# Altium project sigjumper-top.PrjPcb
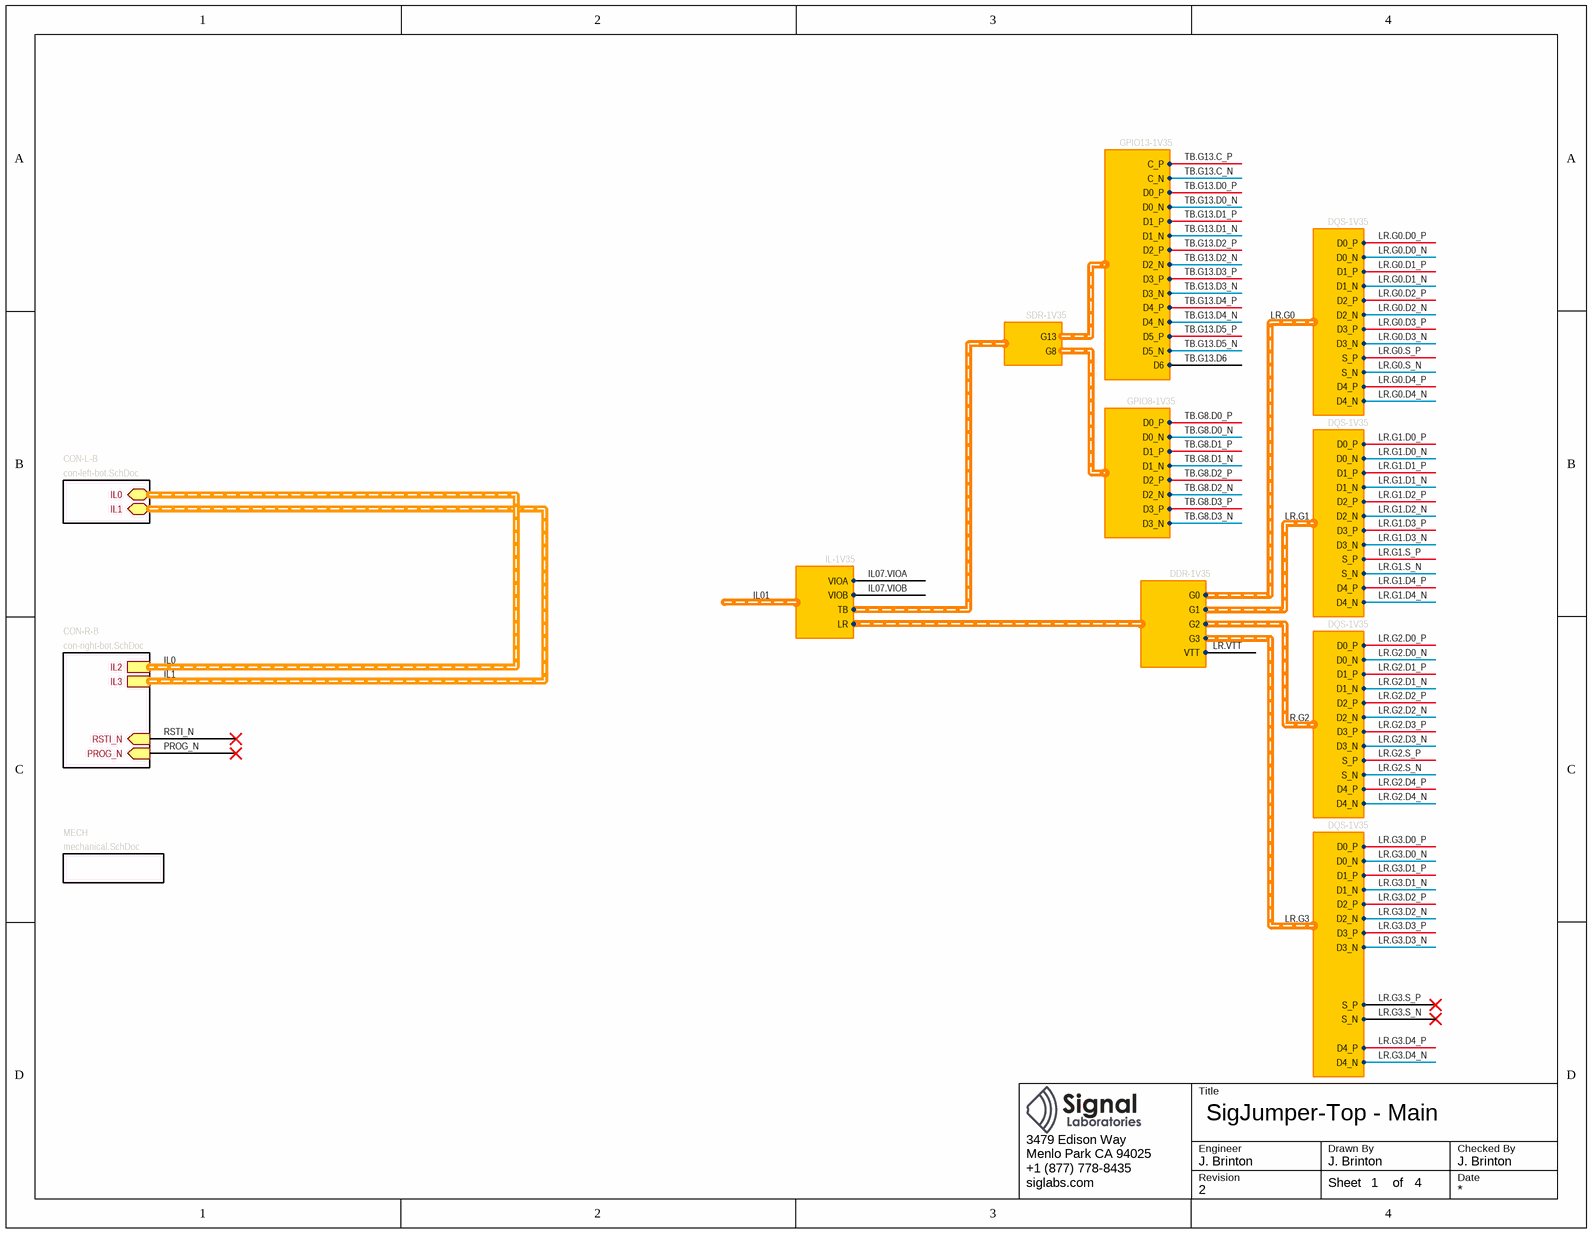
[diagram p0: main.SchDoc]
4 sheets, 24 parts. Net scope: hierarchical (ports join the sheet entries above them; power ports are global).
Board file: sigjumper-top.PcbDoc
Sheets:
  main.SchDoc
    CON-L-B = con-left-bot.SchDoc
    CON-R-B = con-right-bot.SchDoc
    MECH = mechanical.SchDoc

## Sheet main.SchDoc: SigJumper-Top - Main
size Letter; CheckedBy: J. Brinton; CompanyName: Signal Laboratories, Inc.; DrawnBy: J. Brinton; Engineer: J. Brinton; Address1: 3479 Edison Way; Address2: Menlo Park CA 94025; Address3: +1 (877) 778-8435; Address4: siglabs.com; Revision: 2; SheetNumber: 1; SheetTotal: 4

### Sub-sheets
CON-L-B = con-left-bot.SchDoc: IL0 (harness IL-1V35), IL1 (harness IL-1V35)
CON-R-B = con-right-bot.SchDoc: IL3 (harness IL-1V35), RSTI_N (in), PROG_N (in), IL2 (harness IL-1V35)
MECH = mechanical.SchDoc: no entries

### Harnesses
GPIO8-1V35: D0_P, D0_N, D1_P, D1_N, D2_P, D2_N, D3_P, D3_N
SDR-1V35: G13, G8
GPIO13-1V35: C_P, C_N, D0_P, D0_N, D1_P, D1_N, D2_P, D2_N, D3_P, D3_N, D4_P, D4_N, D5_P, D5_N, D6
DQS-1V35: D0_P, D0_N, D1_P, D1_N, D2_P, D2_N, D3_P, D3_N, D4_P, D4_N, S_P, S_N
DDR-1V35: G0, G1, G2, G3, VTT
IL-1V35: LR, TB, VIOA, VIOB

### Nets
IL07.VIOA: harness IL-1V35.VIOA  [project net IL01.VIOA]
IL07.VIOB: harness IL-1V35.VIOB  [project net IL01.VIOB]
LR.G0.D0_N: harness DQS-1V35.D0_N
LR.G0.D0_P: harness DQS-1V35.D0_P
LR.G0.D1_N: harness DQS-1V35.D1_N
LR.G0.D1_P: harness DQS-1V35.D1_P
LR.G0.D2_N: harness DQS-1V35.D2_N
LR.G0.D2_P: harness DQS-1V35.D2_P
LR.G0.D3_N: harness DQS-1V35.D3_N
LR.G0.D3_P: harness DQS-1V35.D3_P
LR.G0.D4_N: harness DQS-1V35.D4_N
LR.G0.D4_P: harness DQS-1V35.D4_P
LR.G0.S_N: harness DQS-1V35.S_N
LR.G0.S_P: harness DQS-1V35.S_P
LR.G1.D0_N: harness DQS-1V35.D0_N
LR.G1.D0_P: harness DQS-1V35.D0_P
LR.G1.D1_N: harness DQS-1V35.D1_N
LR.G1.D1_P: harness DQS-1V35.D1_P
LR.G1.D2_N: harness DQS-1V35.D2_N
LR.G1.D2_P: harness DQS-1V35.D2_P
LR.G1.D3_N: harness DQS-1V35.D3_N
LR.G1.D3_P: harness DQS-1V35.D3_P
LR.G1.D4_N: harness DQS-1V35.D4_N
LR.G1.D4_P: harness DQS-1V35.D4_P
LR.G1.S_N: harness DQS-1V35.S_N
LR.G1.S_P: harness DQS-1V35.S_P
LR.G2.D0_N: harness DQS-1V35.D0_N
LR.G2.D0_P: harness DQS-1V35.D0_P
LR.G2.D1_N: harness DQS-1V35.D1_N
LR.G2.D1_P: harness DQS-1V35.D1_P
LR.G2.D2_N: harness DQS-1V35.D2_N
LR.G2.D2_P: harness DQS-1V35.D2_P
LR.G2.D3_N: harness DQS-1V35.D3_N
LR.G2.D3_P: harness DQS-1V35.D3_P
LR.G2.D4_N: harness DQS-1V35.D4_N
LR.G2.D4_P: harness DQS-1V35.D4_P
LR.G2.S_N: harness DQS-1V35.S_N
LR.G2.S_P: harness DQS-1V35.S_P
LR.G3.D0_N: harness DQS-1V35.D0_N
LR.G3.D0_P: harness DQS-1V35.D0_P
LR.G3.D1_N: harness DQS-1V35.D1_N
LR.G3.D1_P: harness DQS-1V35.D1_P
LR.G3.D2_N: harness DQS-1V35.D2_N
LR.G3.D2_P: harness DQS-1V35.D2_P
LR.G3.D3_N: harness DQS-1V35.D3_N
LR.G3.D3_P: harness DQS-1V35.D3_P
LR.G3.D4_N: harness DQS-1V35.D4_N
LR.G3.D4_P: harness DQS-1V35.D4_P
LR.G3.S_N: harness DQS-1V35.S_N
LR.G3.S_P: harness DQS-1V35.S_P
LR.VTT: harness DDR-1V35.VTT
TB.G8.D0_N: harness GPIO8-1V35.D0_N
TB.G8.D0_P: harness GPIO8-1V35.D0_P
TB.G8.D1_N: harness GPIO8-1V35.D1_N
TB.G8.D1_P: harness GPIO8-1V35.D1_P
TB.G8.D2_N: harness GPIO8-1V35.D2_N
TB.G8.D2_P: harness GPIO8-1V35.D2_P
TB.G8.D3_N: harness GPIO8-1V35.D3_N
TB.G8.D3_P: harness GPIO8-1V35.D3_P
TB.G13.C_N: harness GPIO13-1V35.C_N
TB.G13.C_P: harness GPIO13-1V35.C_P
TB.G13.D0_N: harness GPIO13-1V35.D0_N
TB.G13.D0_P: harness GPIO13-1V35.D0_P
TB.G13.D1_N: harness GPIO13-1V35.D1_N
TB.G13.D1_P: harness GPIO13-1V35.D1_P
TB.G13.D2_N: harness GPIO13-1V35.D2_N
TB.G13.D2_P: harness GPIO13-1V35.D2_P
TB.G13.D3_N: harness GPIO13-1V35.D3_N
TB.G13.D3_P: harness GPIO13-1V35.D3_P
TB.G13.D4_N: harness GPIO13-1V35.D4_N
TB.G13.D4_P: harness GPIO13-1V35.D4_P
TB.G13.D5_N: harness GPIO13-1V35.D5_N
TB.G13.D5_P: harness GPIO13-1V35.D5_P
TB.G13.D6: harness GPIO13-1V35.D6

### Buses and harness runs
harness IL0 = sheet CON-L-B/IL0 = sheet CON-R-B/IL2
harness IL1 = sheet CON-L-B/IL1 = sheet CON-R-B/IL3

### Notes on the sheet
- Title
- Engineer
- Revision
- Drawn By
- Checked By
- Date
- Sheet
- of

## Sheet con-left-bot.SchDoc: SigJumper-Top - Left Bottom
size Letter; CheckedBy: J. Brinton; CompanyName: Signal Laboratories, Inc.; DrawnBy: J. Brinton; Engineer: J. Brinton; Address1: 3479 Edison Way; Address2: Menlo Park CA 94025; Address3: +1 (877) 778-8435; Address4: siglabs.com; Revision: 2; SheetNumber: 4; SheetTotal: 4
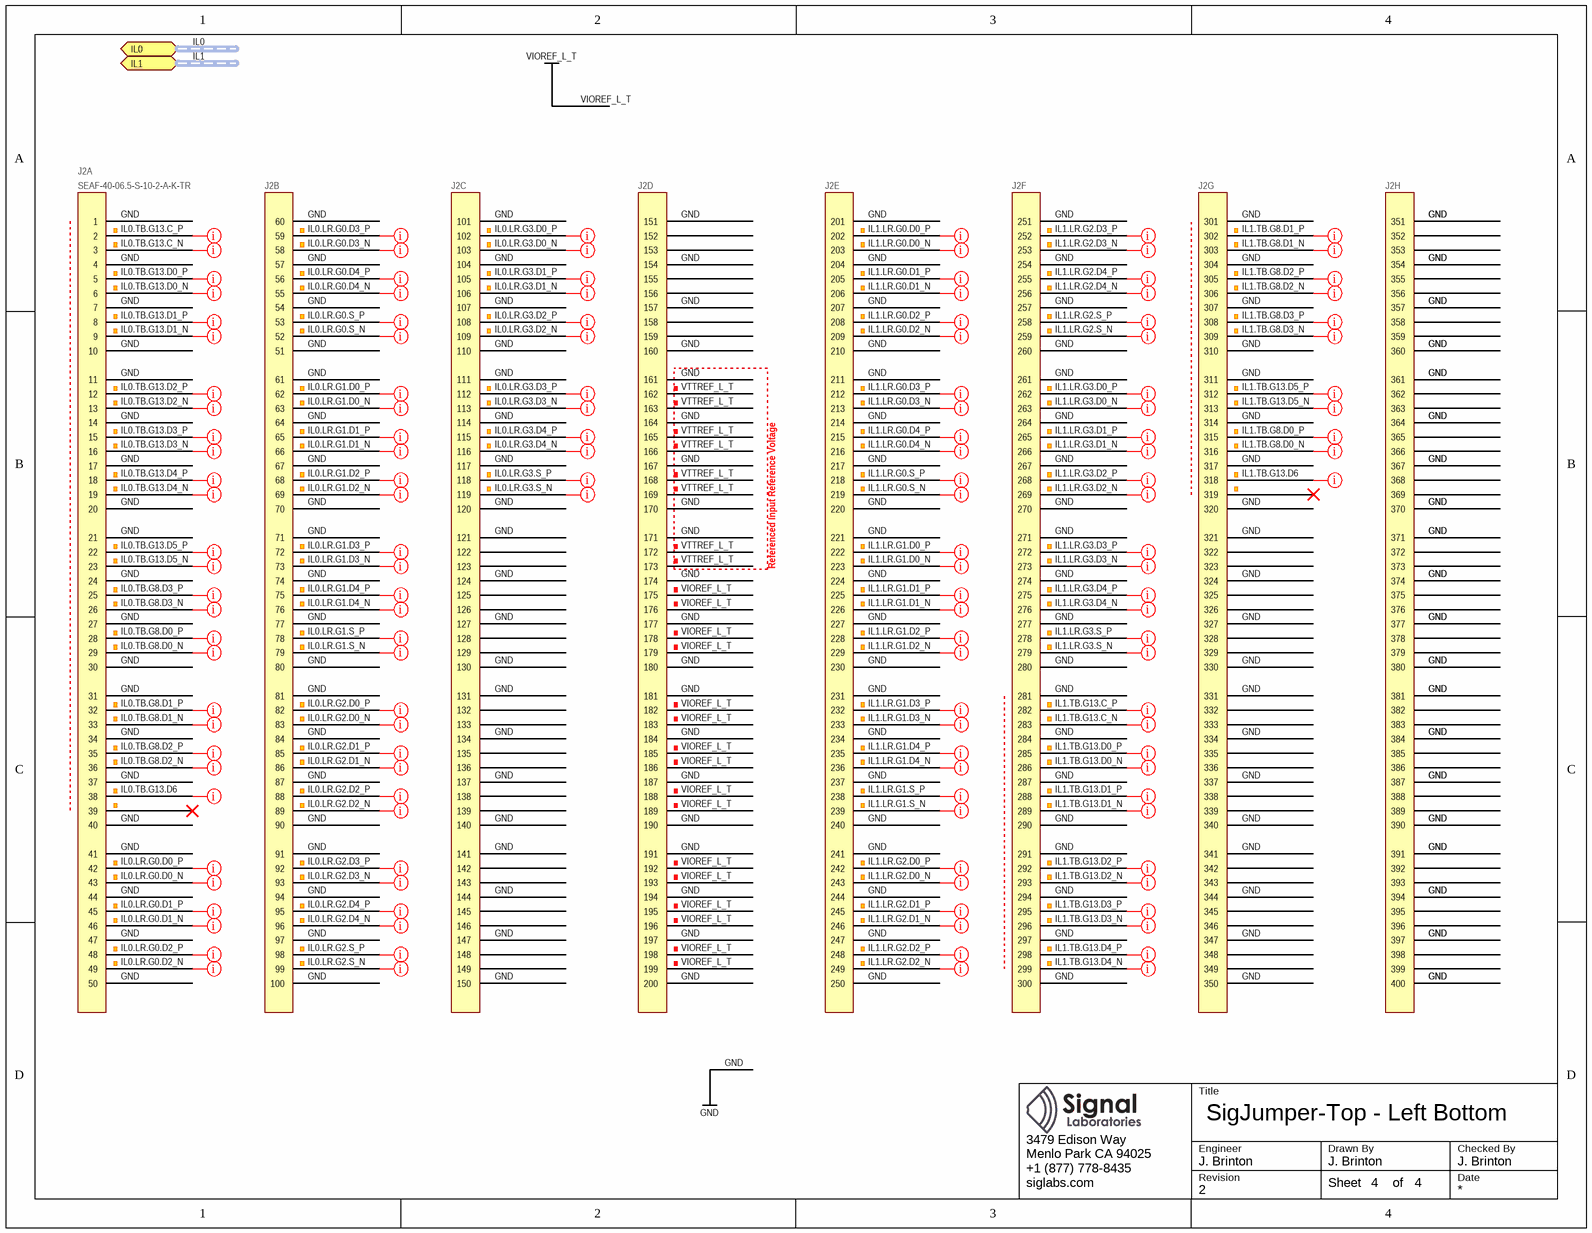
[diagram p1: con-left-bot.SchDoc]

### Parts
J2  SEAF-40-06.5-S-10-2-A-K-TR  [SEAF-40-06.5-S-10-2-A-K-TR]  (parts A,B,C,D,E,F,G,H of 8)

### Ports
IL0 (harness IL-1V35), IL1 (harness IL-1V35)

### Nets
GND: J2.1 J2.4 J2.7 J2.10 J2.11 J2.14 J2.17 J2.20 J2.21 J2.24 J2.27 J2.30 J2.31 J2.34 J2.37 J2.40 J2.41 J2.44 J2.47 J2.50 J2.51 J2.54 J2.57 J2.60 J2.61 J2.64 J2.67 J2.70 J2.71 J2.74 J2.77 J2.80 J2.81 J2.84 J2.87 J2.90 J2.91 J2.94 J2.97 J2.100 J2.101 J2.104 J2.107 J2.110 J2.111 J2.114 J2.117 J2.120 J2.121 J2.124 J2.127 J2.130 J2.131 J2.134 J2.137 J2.140 J2.141 J2.144 J2.147 J2.150 J2.151 J2.154 J2.157 J2.160 J2.161 J2.164 J2.167 J2.170 J2.171 J2.174 J2.177 J2.180 J2.181 J2.184 J2.187 J2.190 J2.191 J2.194 J2.197 J2.200 J2.201 J2.204 J2.207 J2.210 J2.211 J2.214 J2.217 J2.220 J2.221 J2.224 J2.227 J2.230 J2.231 J2.234 J2.237 J2.240 J2.241 J2.244 J2.247 J2.250 J2.251 J2.254 J2.257 J2.260 J2.261 J2.264 J2.267 J2.270 J2.271 J2.274 J2.277 J2.280 J2.281 J2.284 J2.287 J2.290 J2.291 J2.294 J2.297 J2.300 J2.301 J2.304 J2.307 J2.310 J2.311 J2.314 J2.317 J2.320 J2.321 J2.324 J2.327 J2.330 J2.331 J2.334 J2.337 J2.340 J2.341 J2.344 J2.347 J2.350 J2.351 J2.354 J2.357 J2.360 J2.361 J2.364 J2.367 J2.370 J2.371 J2.374 J2.377 J2.380 J2.381 J2.384 J2.387 J2.390 J2.391 J2.394 J2.397 J2.400
VIOREF_L_T: J2.175 J2.176 J2.178 J2.179 J2.182 J2.183 J2.185 J2.186 J2.188 J2.189 J2.192 J2.193 J2.195 J2.196 J2.198 J2.199
IL0.LR.G0.D0_N: J2.43
IL0.LR.G0.D0_P: J2.42
IL0.LR.G0.D1_N: J2.46
IL0.LR.G0.D1_P: J2.45
IL0.LR.G0.D2_N: J2.49
IL0.LR.G0.D2_P: J2.48
IL0.LR.G0.D3_N: J2.58
IL0.LR.G0.D3_P: J2.59
IL0.LR.G0.D4_N: J2.55
IL0.LR.G0.D4_P: J2.56
IL0.LR.G0.S_N: J2.52
IL0.LR.G0.S_P: J2.53
IL0.LR.G1.D0_N: J2.63
IL0.LR.G1.D0_P: J2.62
IL0.LR.G1.D1_N: J2.66
IL0.LR.G1.D1_P: J2.65
IL0.LR.G1.D2_N: J2.69
IL0.LR.G1.D2_P: J2.68
IL0.LR.G1.D3_N: J2.73
IL0.LR.G1.D3_P: J2.72
IL0.LR.G1.D4_N: J2.76
IL0.LR.G1.D4_P: J2.75
IL0.LR.G1.S_N: J2.79
IL0.LR.G1.S_P: J2.78
IL0.LR.G2.D0_N: J2.83
IL0.LR.G2.D0_P: J2.82
IL0.LR.G2.D1_N: J2.86
IL0.LR.G2.D1_P: J2.85
IL0.LR.G2.D2_N: J2.89
IL0.LR.G2.D2_P: J2.88
IL0.LR.G2.D3_N: J2.93
IL0.LR.G2.D3_P: J2.92
IL0.LR.G2.D4_N: J2.96
IL0.LR.G2.D4_P: J2.95
IL0.LR.G2.S_N: J2.99
IL0.LR.G2.S_P: J2.98
IL0.LR.G3.D0_N: J2.103
IL0.LR.G3.D0_P: J2.102
IL0.LR.G3.D1_N: J2.106
IL0.LR.G3.D1_P: J2.105
IL0.LR.G3.D2_N: J2.109
IL0.LR.G3.D2_P: J2.108
IL0.LR.G3.D3_N: J2.113
IL0.LR.G3.D3_P: J2.112
IL0.LR.G3.D4_N: J2.116
IL0.LR.G3.D4_P: J2.115
IL0.LR.G3.S_N: J2.119
IL0.LR.G3.S_P: J2.118
IL0.TB.G8.D0_N: J2.29
IL0.TB.G8.D0_P: J2.28
IL0.TB.G8.D1_N: J2.33
IL0.TB.G8.D1_P: J2.32
IL0.TB.G8.D2_N: J2.36
IL0.TB.G8.D2_P: J2.35
IL0.TB.G8.D3_N: J2.26
IL0.TB.G8.D3_P: J2.25
IL0.TB.G13.C_N: J2.3
IL0.TB.G13.C_P: J2.2
IL0.TB.G13.D0_N: J2.6
IL0.TB.G13.D0_P: J2.5
IL0.TB.G13.D1_N: J2.9
IL0.TB.G13.D1_P: J2.8
IL0.TB.G13.D2_N: J2.13
IL0.TB.G13.D2_P: J2.12
IL0.TB.G13.D3_N: J2.16
IL0.TB.G13.D3_P: J2.15
IL0.TB.G13.D4_N: J2.19
IL0.TB.G13.D4_P: J2.18
IL0.TB.G13.D5_N: J2.23
IL0.TB.G13.D5_P: J2.22
IL0.TB.G13.D6: J2.38
IL1.LR.G0.D0_N: J2.203
IL1.LR.G0.D0_P: J2.202
IL1.LR.G0.D1_N: J2.206
IL1.LR.G0.D1_P: J2.205
IL1.LR.G0.D2_N: J2.209
IL1.LR.G0.D2_P: J2.208
IL1.LR.G0.D3_N: J2.213
IL1.LR.G0.D3_P: J2.212
IL1.LR.G0.D4_N: J2.216
IL1.LR.G0.D4_P: J2.215
IL1.LR.G0.S_N: J2.219
IL1.LR.G0.S_P: J2.218
IL1.LR.G1.D0_N: J2.223
IL1.LR.G1.D0_P: J2.222
IL1.LR.G1.D1_N: J2.226
IL1.LR.G1.D1_P: J2.225
IL1.LR.G1.D2_N: J2.229
IL1.LR.G1.D2_P: J2.228
IL1.LR.G1.D3_N: J2.233
IL1.LR.G1.D3_P: J2.232
IL1.LR.G1.D4_N: J2.236
IL1.LR.G1.D4_P: J2.235
IL1.LR.G1.S_N: J2.239
IL1.LR.G1.S_P: J2.238
IL1.LR.G2.D0_N: J2.243
IL1.LR.G2.D0_P: J2.242
IL1.LR.G2.D1_N: J2.246
IL1.LR.G2.D1_P: J2.245
IL1.LR.G2.D2_N: J2.249
IL1.LR.G2.D2_P: J2.248
IL1.LR.G2.D3_N: J2.253
IL1.LR.G2.D3_P: J2.252
IL1.LR.G2.D4_N: J2.256
IL1.LR.G2.D4_P: J2.255
IL1.LR.G2.S_N: J2.259
IL1.LR.G2.S_P: J2.258
IL1.LR.G3.D0_N: J2.263
IL1.LR.G3.D0_P: J2.262
IL1.LR.G3.D1_N: J2.266
IL1.LR.G3.D1_P: J2.265
IL1.LR.G3.D2_N: J2.269
IL1.LR.G3.D2_P: J2.268
IL1.LR.G3.D3_N: J2.273
IL1.LR.G3.D3_P: J2.272
IL1.LR.G3.D4_N: J2.276
IL1.LR.G3.D4_P: J2.275
IL1.LR.G3.S_N: J2.279
IL1.LR.G3.S_P: J2.278
IL1.TB.G8.D0_N: J2.316
IL1.TB.G8.D0_P: J2.315
IL1.TB.G8.D1_N: J2.303
IL1.TB.G8.D1_P: J2.302
IL1.TB.G8.D2_N: J2.306
IL1.TB.G8.D2_P: J2.305
IL1.TB.G8.D3_N: J2.309
IL1.TB.G8.D3_P: J2.308
IL1.TB.G13.C_N: J2.283
IL1.TB.G13.C_P: J2.282
IL1.TB.G13.D0_N: J2.286
IL1.TB.G13.D0_P: J2.285
IL1.TB.G13.D1_N: J2.289
IL1.TB.G13.D1_P: J2.288
IL1.TB.G13.D2_N: J2.293
IL1.TB.G13.D2_P: J2.292
IL1.TB.G13.D3_N: J2.296
IL1.TB.G13.D3_P: J2.295
IL1.TB.G13.D4_N: J2.299
IL1.TB.G13.D4_P: J2.298
IL1.TB.G13.D5_N: J2.313
IL1.TB.G13.D5_P: J2.312
IL1.TB.G13.D6: J2.318
VTTREF_L_T: J2.162 J2.163 J2.165 J2.166 J2.168 J2.169 J2.172 J2.173

Not connected (* = marked no-connect by the designer): J2 39* 122 123 125 126 128 129 132 133 135 136 138 139 142 143 145 146 148 149 152 153 155 156 158 159 319* 322 323 325 326 328 329 332 333 335 336 338 339 342 343 345 346 348 349 352 353 355 356 358 359 362 363 365 366 368 369 372 373 375 376 378 379 382 383 385 386 388 389 392 393 395 396 398 399

### Buses and harness runs
harness IL0 = port IL0
harness IL1 = port IL1

### Layout directives
net class z50; differential pair; net class loose: IL0.LR.G0.D0_N, IL0.LR.G0.D0_P, IL0.LR.G0.D1_N, IL0.LR.G0.D1_P, IL0.LR.G0.D2_N, IL0.LR.G0.D2_P, IL0.LR.G0.D3_N, IL0.LR.G0.D3_P, IL0.LR.G0.D4_N, IL0.LR.G0.D4_P, IL0.LR.G0.S_N, IL0.LR.G0.S_P, IL0.LR.G1.D0_N, IL0.LR.G1.D0_P, IL0.LR.G1.D1_N, IL0.LR.G1.D1_P, IL0.LR.G1.D2_N, IL0.LR.G1.D2_P, IL0.LR.G1.D3_N, IL0.LR.G1.D3_P, IL0.LR.G1.D4_N, IL0.LR.G1.D4_P, IL0.LR.G1.S_N, IL0.LR.G1.S_P, IL0.LR.G2.D0_N, IL0.LR.G2.D0_P, IL0.LR.G2.D1_N, IL0.LR.G2.D1_P, IL0.LR.G2.D2_N, IL0.LR.G2.D2_P, IL0.LR.G2.D3_N, IL0.LR.G2.D3_P, IL0.LR.G2.D4_N, IL0.LR.G2.D4_P, IL0.LR.G2.S_N, IL0.LR.G2.S_P, IL0.LR.G3.D0_N, IL0.LR.G3.D0_P, IL0.LR.G3.D1_N, IL0.LR.G3.D1_P, IL0.LR.G3.D2_N, IL0.LR.G3.D2_P, IL0.LR.G3.D3_N, IL0.LR.G3.D3_P, IL0.LR.G3.D4_N, IL0.LR.G3.D4_P, IL0.LR.G3.S_N, IL0.LR.G3.S_P, IL0.TB.G8.D0_N, IL0.TB.G8.D0_P, IL0.TB.G8.D1_N, IL0.TB.G8.D1_P, IL0.TB.G8.D2_N, IL0.TB.G8.D2_P, IL0.TB.G8.D3_N, IL0.TB.G8.D3_P, IL0.TB.G13.C_N, IL0.TB.G13.C_P, IL0.TB.G13.D0_N, IL0.TB.G13.D0_P, IL0.TB.G13.D1_N, IL0.TB.G13.D1_P, IL0.TB.G13.D2_N, IL0.TB.G13.D2_P, IL0.TB.G13.D3_N, IL0.TB.G13.D3_P, IL0.TB.G13.D4_N, IL0.TB.G13.D4_P, IL0.TB.G13.D5_N, IL0.TB.G13.D5_P, IL1.LR.G0.D0_N, IL1.LR.G0.D0_P, IL1.LR.G0.D1_N, IL1.LR.G0.D1_P, IL1.LR.G0.D2_N, IL1.LR.G0.D2_P, IL1.LR.G0.D3_N, IL1.LR.G0.D3_P, IL1.LR.G0.D4_N, IL1.LR.G0.D4_P, IL1.LR.G0.S_N, IL1.LR.G0.S_P, IL1.LR.G1.D0_N, IL1.LR.G1.D0_P, IL1.LR.G1.D1_N, IL1.LR.G1.D1_P, IL1.LR.G1.D2_N, IL1.LR.G1.D2_P, IL1.LR.G1.D3_N, IL1.LR.G1.D3_P, IL1.LR.G1.D4_N, IL1.LR.G1.D4_P, IL1.LR.G1.S_N, IL1.LR.G1.S_P, IL1.LR.G2.D0_N, IL1.LR.G2.D0_P, IL1.LR.G2.D1_N, IL1.LR.G2.D1_P, IL1.LR.G2.D2_N, IL1.LR.G2.D2_P, IL1.LR.G2.D3_N, IL1.LR.G2.D3_P, IL1.LR.G2.D4_N, IL1.LR.G2.D4_P, IL1.LR.G2.S_N, IL1.LR.G2.S_P, IL1.LR.G3.D0_N, IL1.LR.G3.D0_P, IL1.LR.G3.D1_N, IL1.LR.G3.D1_P, IL1.LR.G3.D2_N, IL1.LR.G3.D2_P, IL1.LR.G3.D3_N, IL1.LR.G3.D3_P, IL1.LR.G3.D4_N, IL1.LR.G3.D4_P, IL1.LR.G3.S_N, IL1.LR.G3.S_P, IL1.TB.G8.D0_N, IL1.TB.G8.D0_P, IL1.TB.G8.D1_N, IL1.TB.G8.D1_P, IL1.TB.G8.D2_N, IL1.TB.G8.D2_P, IL1.TB.G8.D3_N, IL1.TB.G8.D3_P, IL1.TB.G13.C_N, IL1.TB.G13.C_P, IL1.TB.G13.D0_N, IL1.TB.G13.D0_P, IL1.TB.G13.D1_N, IL1.TB.G13.D1_P, IL1.TB.G13.D2_N, IL1.TB.G13.D2_P, IL1.TB.G13.D3_N, IL1.TB.G13.D3_P, IL1.TB.G13.D4_N, IL1.TB.G13.D4_P, IL1.TB.G13.D5_N, IL1.TB.G13.D5_P
net class z50: IL0.TB.G13.D6, IL1.TB.G13.D6

### Notes on the sheet
- Referenced Input Reference Voltage
- Title
- Engineer
- Revision
- Drawn By
- Checked By
- Date
- Sheet
- of

### Library data of the parts
J2 = SEAF-40-06.5-S-10-2-A-K-TR: Terminal Array Assembly, Surface Mount, 0.050" Pitch, 400 Pins; Manufacturer: Samtec; Manufacturer P/N: SEAF-40-06.5-S-10-2-A-K-TR

## Sheet con-right-bot.SchDoc: SigJumper-Top - Right Bottom
size Letter; CheckedBy: J. Brinton; CompanyName: Signal Laboratories, Inc.; DrawnBy: J. Brinton; Engineer: J. Brinton; Address1: 3479 Edison Way; Address2: Menlo Park CA 94025; Address3: +1 (877) 778-8435; Address4: siglabs.com; Revision: 2; SheetNumber: 2; SheetTotal: 4
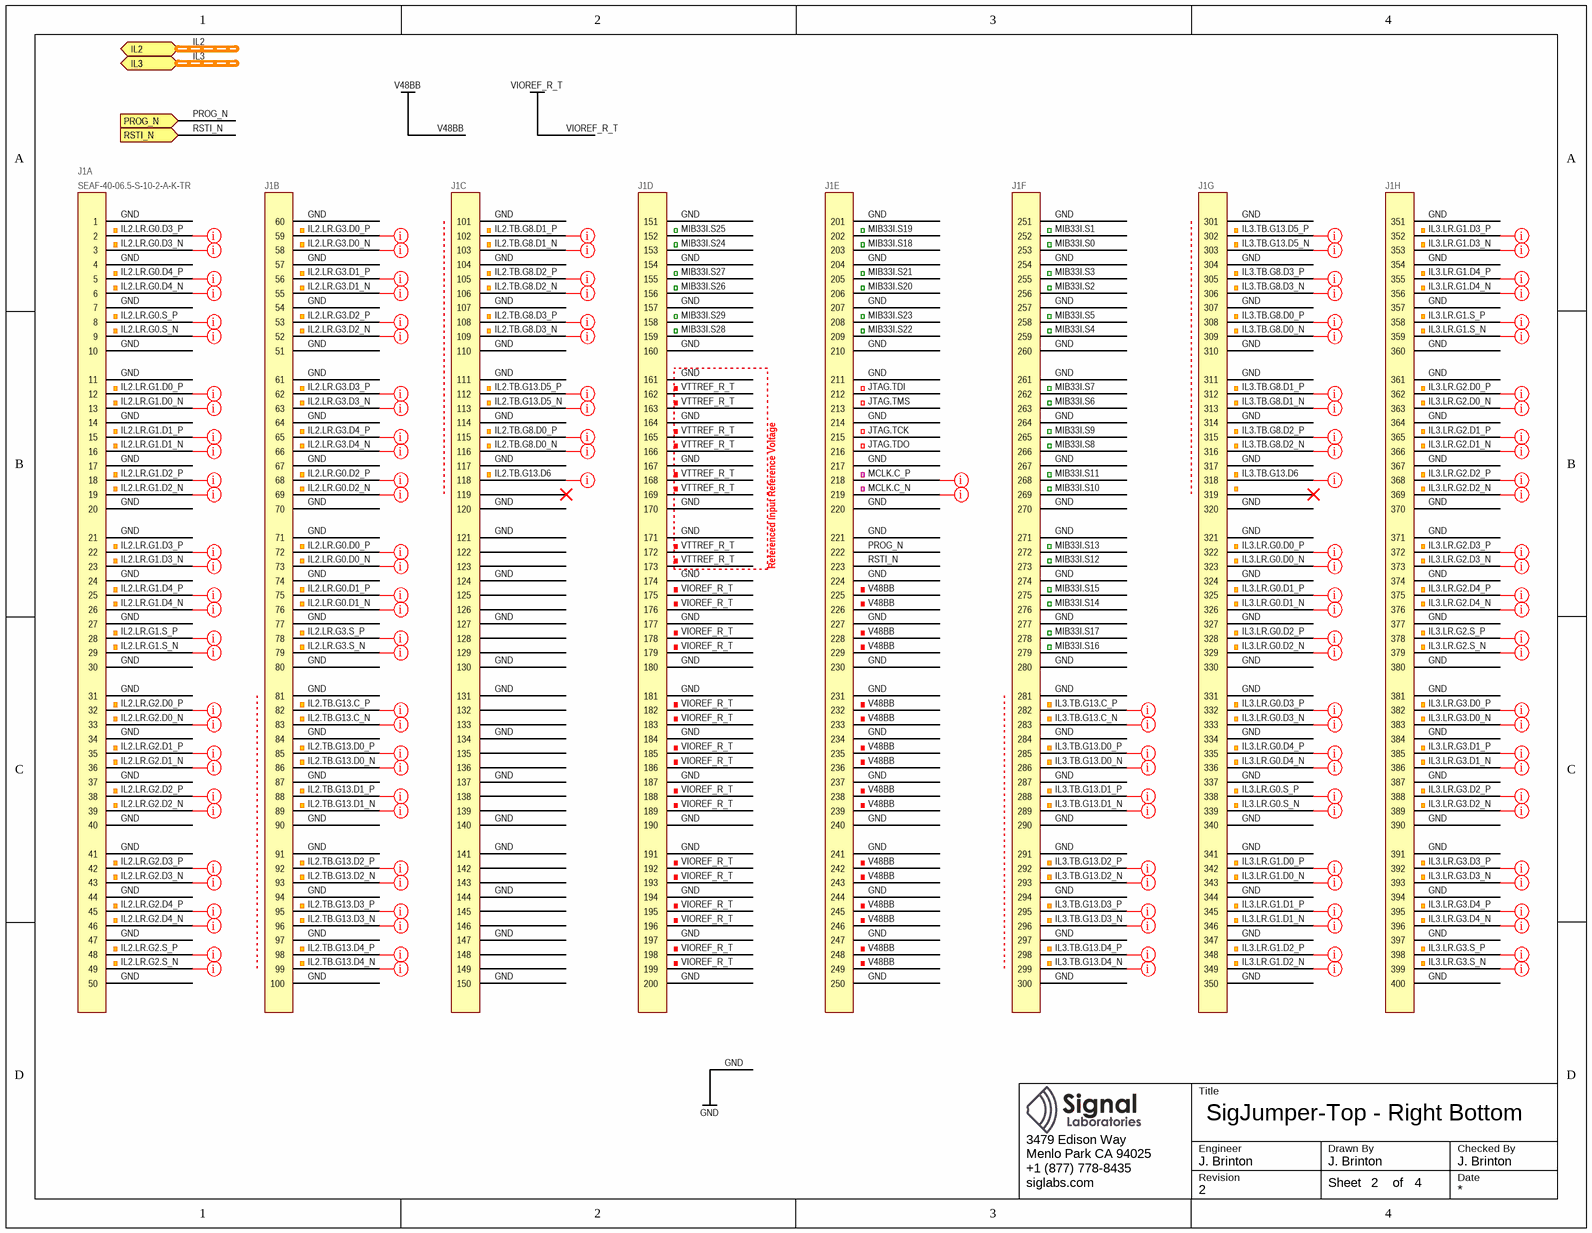
[diagram p2: con-right-bot.SchDoc]

### Parts
J1  SEAF-40-06.5-S-10-2-A-K-TR  [SEAF-40-06.5-S-10-2-A-K-TR]  (parts A,B,C,D,E,F,G,H of 8)

### Ports
IL2 (harness IL-1V35), IL3 (harness IL-1V35), PROG_N (in), RSTI_N (in)

### Nets
GND: J1.1 J1.4 J1.7 J1.10 J1.11 J1.14 J1.17 J1.20 J1.21 J1.24 J1.27 J1.30 J1.31 J1.34 J1.37 J1.40 J1.41 J1.44 J1.47 J1.50 J1.51 J1.54 J1.57 J1.60 J1.61 J1.64 J1.67 J1.70 J1.71 J1.74 J1.77 J1.80 J1.81 J1.84 J1.87 J1.90 J1.91 J1.94 J1.97 J1.100 J1.101 J1.104 J1.107 J1.110 J1.111 J1.114 J1.117 J1.120 J1.121 J1.124 J1.127 J1.130 J1.131 J1.134 J1.137 J1.140 J1.141 J1.144 J1.147 J1.150 J1.151 J1.154 J1.157 J1.160 J1.161 J1.164 J1.167 J1.170 J1.171 J1.174 J1.177 J1.180 J1.181 J1.184 J1.187 J1.190 J1.191 J1.194 J1.197 J1.200 J1.201 J1.204 J1.207 J1.210 J1.211 J1.214 J1.217 J1.220 J1.221 J1.224 J1.227 J1.230 J1.231 J1.234 J1.237 J1.240 J1.241 J1.244 J1.247 J1.250 J1.251 J1.254 J1.257 J1.260 J1.261 J1.264 J1.267 J1.270 J1.271 J1.274 J1.277 J1.280 J1.281 J1.284 J1.287 J1.290 J1.291 J1.294 J1.297 J1.300 J1.301 J1.304 J1.307 J1.310 J1.311 J1.314 J1.317 J1.320 J1.321 J1.324 J1.327 J1.330 J1.331 J1.334 J1.337 J1.340 J1.341 J1.344 J1.347 J1.350 J1.351 J1.354 J1.357 J1.360 J1.361 J1.364 J1.367 J1.370 J1.371 J1.374 J1.377 J1.380 J1.381 J1.384 J1.387 J1.390 J1.391 J1.394 J1.397 J1.400
V48BB: J1.225 J1.226 J1.228 J1.229 J1.232 J1.233 J1.235 J1.236 J1.238 J1.239 J1.242 J1.243 J1.245 J1.246 J1.248 J1.249
VIOREF_R_T: J1.175 J1.176 J1.178 J1.179 J1.182 J1.183 J1.185 J1.186 J1.188 J1.189 J1.192 J1.193 J1.195 J1.196 J1.198 J1.199
IL2.LR.G0.D0_N: J1.73
IL2.LR.G0.D0_P: J1.72
IL2.LR.G0.D1_N: J1.76
IL2.LR.G0.D1_P: J1.75
IL2.LR.G0.D2_N: J1.69
IL2.LR.G0.D2_P: J1.68
IL2.LR.G0.D3_N: J1.3
IL2.LR.G0.D3_P: J1.2
IL2.LR.G0.D4_N: J1.6
IL2.LR.G0.D4_P: J1.5
IL2.LR.G0.S_N: J1.9
IL2.LR.G0.S_P: J1.8
IL2.LR.G1.D0_N: J1.13
IL2.LR.G1.D0_P: J1.12
IL2.LR.G1.D1_N: J1.16
IL2.LR.G1.D1_P: J1.15
IL2.LR.G1.D2_N: J1.19
IL2.LR.G1.D2_P: J1.18
IL2.LR.G1.D3_N: J1.23
IL2.LR.G1.D3_P: J1.22
IL2.LR.G1.D4_N: J1.26
IL2.LR.G1.D4_P: J1.25
IL2.LR.G1.S_N: J1.29
IL2.LR.G1.S_P: J1.28
IL2.LR.G2.D0_N: J1.33
IL2.LR.G2.D0_P: J1.32
IL2.LR.G2.D1_N: J1.36
IL2.LR.G2.D1_P: J1.35
IL2.LR.G2.D2_N: J1.39
IL2.LR.G2.D2_P: J1.38
IL2.LR.G2.D3_N: J1.43
IL2.LR.G2.D3_P: J1.42
IL2.LR.G2.D4_N: J1.46
IL2.LR.G2.D4_P: J1.45
IL2.LR.G2.S_N: J1.49
IL2.LR.G2.S_P: J1.48
IL2.LR.G3.D0_N: J1.58
IL2.LR.G3.D0_P: J1.59
IL2.LR.G3.D1_N: J1.55
IL2.LR.G3.D1_P: J1.56
IL2.LR.G3.D2_N: J1.52
IL2.LR.G3.D2_P: J1.53
IL2.LR.G3.D3_N: J1.63
IL2.LR.G3.D3_P: J1.62
IL2.LR.G3.D4_N: J1.66
IL2.LR.G3.D4_P: J1.65
IL2.LR.G3.S_N: J1.79
IL2.LR.G3.S_P: J1.78
IL2.TB.G8.D0_N: J1.116
IL2.TB.G8.D0_P: J1.115
IL2.TB.G8.D1_N: J1.103
IL2.TB.G8.D1_P: J1.102
IL2.TB.G8.D2_N: J1.106
IL2.TB.G8.D2_P: J1.105
IL2.TB.G8.D3_N: J1.109
IL2.TB.G8.D3_P: J1.108
IL2.TB.G13.C_N: J1.83
IL2.TB.G13.C_P: J1.82
IL2.TB.G13.D0_N: J1.86
IL2.TB.G13.D0_P: J1.85
IL2.TB.G13.D1_N: J1.89
IL2.TB.G13.D1_P: J1.88
IL2.TB.G13.D2_N: J1.93
IL2.TB.G13.D2_P: J1.92
IL2.TB.G13.D3_N: J1.96
IL2.TB.G13.D3_P: J1.95
IL2.TB.G13.D4_N: J1.99
IL2.TB.G13.D4_P: J1.98
IL2.TB.G13.D5_N: J1.113
IL2.TB.G13.D5_P: J1.112
IL2.TB.G13.D6: J1.118
IL3.LR.G0.D0_N: J1.323
IL3.LR.G0.D0_P: J1.322
IL3.LR.G0.D1_N: J1.326
IL3.LR.G0.D1_P: J1.325
IL3.LR.G0.D2_N: J1.329
IL3.LR.G0.D2_P: J1.328
IL3.LR.G0.D3_N: J1.333
IL3.LR.G0.D3_P: J1.332
IL3.LR.G0.D4_N: J1.336
IL3.LR.G0.D4_P: J1.335
IL3.LR.G0.S_N: J1.339
IL3.LR.G0.S_P: J1.338
IL3.LR.G1.D0_N: J1.343
IL3.LR.G1.D0_P: J1.342
IL3.LR.G1.D1_N: J1.346
IL3.LR.G1.D1_P: J1.345
IL3.LR.G1.D2_N: J1.349
IL3.LR.G1.D2_P: J1.348
IL3.LR.G1.D3_N: J1.353
IL3.LR.G1.D3_P: J1.352
IL3.LR.G1.D4_N: J1.356
IL3.LR.G1.D4_P: J1.355
IL3.LR.G1.S_N: J1.359
IL3.LR.G1.S_P: J1.358
IL3.LR.G2.D0_N: J1.363
IL3.LR.G2.D0_P: J1.362
IL3.LR.G2.D1_N: J1.366
IL3.LR.G2.D1_P: J1.365
IL3.LR.G2.D2_N: J1.369
IL3.LR.G2.D2_P: J1.368
IL3.LR.G2.D3_N: J1.373
IL3.LR.G2.D3_P: J1.372
IL3.LR.G2.D4_N: J1.376
IL3.LR.G2.D4_P: J1.375
IL3.LR.G2.S_N: J1.379
IL3.LR.G2.S_P: J1.378
IL3.LR.G3.D0_N: J1.383
IL3.LR.G3.D0_P: J1.382
IL3.LR.G3.D1_N: J1.386
IL3.LR.G3.D1_P: J1.385
IL3.LR.G3.D2_N: J1.389
IL3.LR.G3.D2_P: J1.388
IL3.LR.G3.D3_N: J1.393
IL3.LR.G3.D3_P: J1.392
IL3.LR.G3.D4_N: J1.396
IL3.LR.G3.D4_P: J1.395
IL3.LR.G3.S_N: J1.399
IL3.LR.G3.S_P: J1.398
IL3.TB.G8.D0_N: J1.309
IL3.TB.G8.D0_P: J1.308
IL3.TB.G8.D1_N: J1.313
IL3.TB.G8.D1_P: J1.312
IL3.TB.G8.D2_N: J1.316
IL3.TB.G8.D2_P: J1.315
IL3.TB.G8.D3_N: J1.306
IL3.TB.G8.D3_P: J1.305
IL3.TB.G13.C_N: J1.283
IL3.TB.G13.C_P: J1.282
IL3.TB.G13.D0_N: J1.286
IL3.TB.G13.D0_P: J1.285
IL3.TB.G13.D1_N: J1.289
IL3.TB.G13.D1_P: J1.288
IL3.TB.G13.D2_N: J1.293
IL3.TB.G13.D2_P: J1.292
IL3.TB.G13.D3_N: J1.296
IL3.TB.G13.D3_P: J1.295
IL3.TB.G13.D4_N: J1.299
IL3.TB.G13.D4_P: J1.298
IL3.TB.G13.D5_N: J1.303
IL3.TB.G13.D5_P: J1.302
IL3.TB.G13.D6: J1.318
JTAG.TCK: J1.215
JTAG.TDI: J1.212
JTAG.TDO: J1.216
JTAG.TMS: J1.213
MCLK.C_N: J1.219
MCLK.C_P: J1.218
MIB33I.S0: J1.253
MIB33I.S1: J1.252
MIB33I.S2: J1.256
MIB33I.S3: J1.255
MIB33I.S4: J1.259
MIB33I.S5: J1.258
MIB33I.S6: J1.263
MIB33I.S7: J1.262
MIB33I.S8: J1.266
MIB33I.S9: J1.265
MIB33I.S10: J1.269
MIB33I.S11: J1.268
MIB33I.S12: J1.273
MIB33I.S13: J1.272
MIB33I.S14: J1.276
MIB33I.S15: J1.275
MIB33I.S16: J1.279
MIB33I.S17: J1.278
MIB33I.S18: J1.203
MIB33I.S19: J1.202
MIB33I.S20: J1.206
MIB33I.S21: J1.205
MIB33I.S22: J1.209
MIB33I.S23: J1.208
MIB33I.S24: J1.153
MIB33I.S25: J1.152
MIB33I.S26: J1.156
MIB33I.S27: J1.155
MIB33I.S28: J1.159
MIB33I.S29: J1.158
PROG_N: J1.222 ; port PROG_N
RSTI_N: J1.223 ; port RSTI_N
VTTREF_R_T: J1.162 J1.163 J1.165 J1.166 J1.168 J1.169 J1.172 J1.173

Not connected (* = marked no-connect by the designer): J1 119* 122 123 125 126 128 129 132 133 135 136 138 139 142 143 145 146 148 149 319*

### Buses and harness runs
harness IL2 = port IL2
harness IL3 = port IL3

### Layout directives
net class z50: IL2.TB.G13.D6, IL3.TB.G13.D6
net class z50; differential pair; net class loose: IL2.LR.G0.D0_N, IL2.LR.G0.D0_P, IL2.LR.G0.D1_N, IL2.LR.G0.D1_P, IL2.LR.G0.D2_N, IL2.LR.G0.D2_P, IL2.LR.G0.D3_N, IL2.LR.G0.D3_P, IL2.LR.G0.D4_N, IL2.LR.G0.D4_P, IL2.LR.G0.S_N, IL2.LR.G0.S_P, IL2.LR.G1.D0_N, IL2.LR.G1.D0_P, IL2.LR.G1.D1_N, IL2.LR.G1.D1_P, IL2.LR.G1.D2_N, IL2.LR.G1.D2_P, IL2.LR.G1.D3_N, IL2.LR.G1.D3_P, IL2.LR.G1.D4_N, IL2.LR.G1.D4_P, IL2.LR.G1.S_N, IL2.LR.G1.S_P, IL2.LR.G2.D0_N, IL2.LR.G2.D0_P, IL2.LR.G2.D1_N, IL2.LR.G2.D1_P, IL2.LR.G2.D2_N, IL2.LR.G2.D2_P, IL2.LR.G2.D3_N, IL2.LR.G2.D3_P, IL2.LR.G2.D4_N, IL2.LR.G2.D4_P, IL2.LR.G2.S_N, IL2.LR.G2.S_P, IL2.LR.G3.D0_N, IL2.LR.G3.D0_P, IL2.LR.G3.D1_N, IL2.LR.G3.D1_P, IL2.LR.G3.D2_N, IL2.LR.G3.D2_P, IL2.LR.G3.D3_N, IL2.LR.G3.D3_P, IL2.LR.G3.D4_N, IL2.LR.G3.D4_P, IL2.LR.G3.S_N, IL2.LR.G3.S_P, IL2.TB.G8.D0_N, IL2.TB.G8.D0_P, IL2.TB.G8.D1_N, IL2.TB.G8.D1_P, IL2.TB.G8.D2_N, IL2.TB.G8.D2_P, IL2.TB.G8.D3_N, IL2.TB.G8.D3_P, IL2.TB.G13.C_N, IL2.TB.G13.C_P, IL2.TB.G13.D0_N, IL2.TB.G13.D0_P, IL2.TB.G13.D1_N, IL2.TB.G13.D1_P, IL2.TB.G13.D2_N, IL2.TB.G13.D2_P, IL2.TB.G13.D3_N, IL2.TB.G13.D3_P, IL2.TB.G13.D4_N, IL2.TB.G13.D4_P, IL2.TB.G13.D5_N, IL2.TB.G13.D5_P, IL3.LR.G0.D0_N, IL3.LR.G0.D0_P, IL3.LR.G0.D1_N, IL3.LR.G0.D1_P, IL3.LR.G0.D2_N, IL3.LR.G0.D2_P, IL3.LR.G0.D3_N, IL3.LR.G0.D3_P, IL3.LR.G0.D4_N, IL3.LR.G0.D4_P, IL3.LR.G0.S_N, IL3.LR.G0.S_P, IL3.LR.G1.D0_N, IL3.LR.G1.D0_P, IL3.LR.G1.D1_N, IL3.LR.G1.D1_P, IL3.LR.G1.D2_N, IL3.LR.G1.D2_P, IL3.LR.G1.D3_N, IL3.LR.G1.D3_P, IL3.LR.G1.D4_N, IL3.LR.G1.D4_P, IL3.LR.G1.S_N, IL3.LR.G1.S_P, IL3.LR.G2.D0_N, IL3.LR.G2.D0_P, IL3.LR.G2.D1_N, IL3.LR.G2.D1_P, IL3.LR.G2.D2_N, IL3.LR.G2.D2_P, IL3.LR.G2.D3_N, IL3.LR.G2.D3_P, IL3.LR.G2.D4_N, IL3.LR.G2.D4_P, IL3.LR.G2.S_N, IL3.LR.G2.S_P, IL3.LR.G3.D0_N, IL3.LR.G3.D0_P, IL3.LR.G3.D1_N, IL3.LR.G3.D1_P, IL3.LR.G3.D2_N, IL3.LR.G3.D2_P, IL3.LR.G3.D3_N, IL3.LR.G3.D3_P, IL3.LR.G3.D4_N, IL3.LR.G3.D4_P, IL3.LR.G3.S_N, IL3.LR.G3.S_P, IL3.TB.G8.D0_N, IL3.TB.G8.D0_P, IL3.TB.G8.D1_N, IL3.TB.G8.D1_P, IL3.TB.G8.D2_N, IL3.TB.G8.D2_P, IL3.TB.G8.D3_N, IL3.TB.G8.D3_P, IL3.TB.G13.C_N, IL3.TB.G13.C_P, IL3.TB.G13.D0_N, IL3.TB.G13.D0_P, IL3.TB.G13.D1_N, IL3.TB.G13.D1_P, IL3.TB.G13.D2_N, IL3.TB.G13.D2_P, IL3.TB.G13.D3_N, IL3.TB.G13.D3_P, IL3.TB.G13.D4_N, IL3.TB.G13.D4_P, IL3.TB.G13.D5_N, IL3.TB.G13.D5_P
net class z50; differential pair; net class tight: MCLK.C_N, MCLK.C_P

### Notes on the sheet
- Referenced Input Reference Voltage
- Title
- Engineer
- Revision
- Drawn By
- Checked By
- Date
- Sheet
- of

### Library data of the parts
J1 = SEAF-40-06.5-S-10-2-A-K-TR: as J2 on sheet con-left-bot; Manufacturer P/N: SEAF-40-06.5-S-10-2-A-K-TR

## Sheet mechanical.SchDoc: SigJumper-Top - Mechanical
size Letter; CheckedBy: J. Brinton; CompanyName: Signal Laboratories, Inc.; DrawnBy: J. Brinton; Engineer: J. Brinton; Address1: 3479 Edison Way; Address2: Menlo Park CA 94025; Address3: +1 (877) 778-8435; Address4: siglabs.com; Revision: 2; SheetNumber: 3; SheetTotal: 4
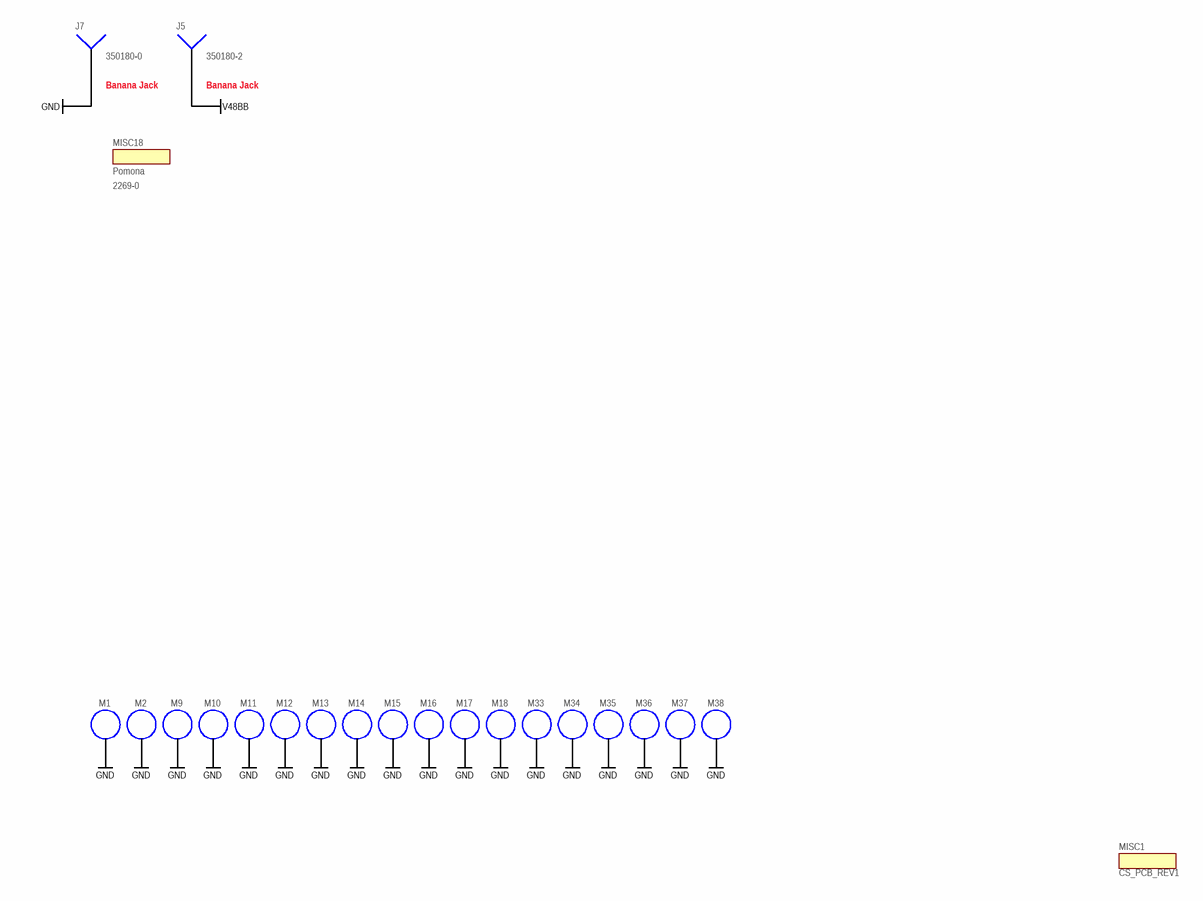
[diagram p3: mechanical.SchDoc]

### Parts
J5  350180-2  [POWER_PAD]  (no BOM)
J7  350180-0  [POWER_PAD]  (no BOM)
M1  MOUNT  [MOUNTM3]  (value not drawn)  (no BOM)
M2  MOUNT  [MOUNTM3]  (value not drawn)  (no BOM)
M9  MOUNT  [MOUNTM3]  (value not drawn)  (no BOM)
M10  MOUNT  [MOUNTM3]  (value not drawn)  (no BOM)
M11  MOUNT  [MOUNTM3]  (value not drawn)  (no BOM)
M12  MOUNT  [MOUNTM3]  (value not drawn)  (no BOM)
M13  MOUNT  [MOUNTM3]  (value not drawn)  (no BOM)
M14  MOUNT  [MOUNTM3]  (value not drawn)  (no BOM)
M15  MOUNT  [MOUNTM3]  (value not drawn)  (no BOM)
M16  MOUNT  [MOUNTM3]  (value not drawn)  (no BOM)
M17  MOUNT  [MOUNTM3]  (value not drawn)  (no BOM)
M18  MOUNT  [MOUNTM3]  (value not drawn)  (no BOM)
M33  MOUNT  [MOUNTM3]  (value not drawn)  (no BOM)
M34  MOUNT  [MOUNTM3]  (value not drawn)  (no BOM)
M35  MOUNT  [MOUNTM3]  (value not drawn)  (no BOM)
M36  MOUNT  [MOUNTM3]  (value not drawn)  (no BOM)
M37  MOUNT  [MOUNTM3]  (value not drawn)  (no BOM)
M38  MOUNT  [MOUNTM3]  (value not drawn)  (no BOM)
MISC1  CS_PCB_REV1  (mechanical)
MISC18  2269-0  Manufacturer: Pomona  (mechanical)

### Nets
GND: J7.1 M1.1(MNT) M2.1(MNT) M9.1(MNT) M10.1(MNT) M11.1(MNT) M12.1(MNT) M13.1(MNT) M14.1(MNT) M15.1(MNT) M16.1(MNT) M17.1(MNT) M18.1(MNT) M33.1(MNT) M34.1(MNT) M35.1(MNT) M36.1(MNT) M37.1(MNT) M38.1(MNT)
V48BB: J5.1

### Notes on the sheet
- Banana Jack
- (near J5) Banana Jack
- Title
- Engineer
- Revision
- Drawn By
- Checked By
- Date
- Sheet
- of

### Library data of the parts
J5 = Socket: Test Probe Assembly; Red; Manufacturer: TE Connectivity; Manufacturer P/N: 350180-2
J7 = Socket: Test Probe Assembly; Black; Manufacturer: TE Connectivity; Manufacturer P/N: 350180-0
M1 M2 M9-M18 M33-M38 = MOUNT: M3 Standard Fit Hole; Manufacturer: *; Manufacturer P/N: *
MISC1 = M50-1900005: Copper Suicide PCB; Manufacturer: Signal Laboratories, Inc.; Manufacturer P/N: CS_PCB_REV1
MISC18 = M50-1900005: Double Banana Jack Connector; Do Not Place: PURCHASE BUT DNP; Manufacturer P/N: 2269-0

## Nets that join several sheets
GND: con-left-bot (160 pins), con-right-bot (160 pins), mechanical (19 pins)
V48BB: con-right-bot (16 pins), mechanical (J5.1)